# Altium schematic sheet Sheet5.SchDoc
size A4
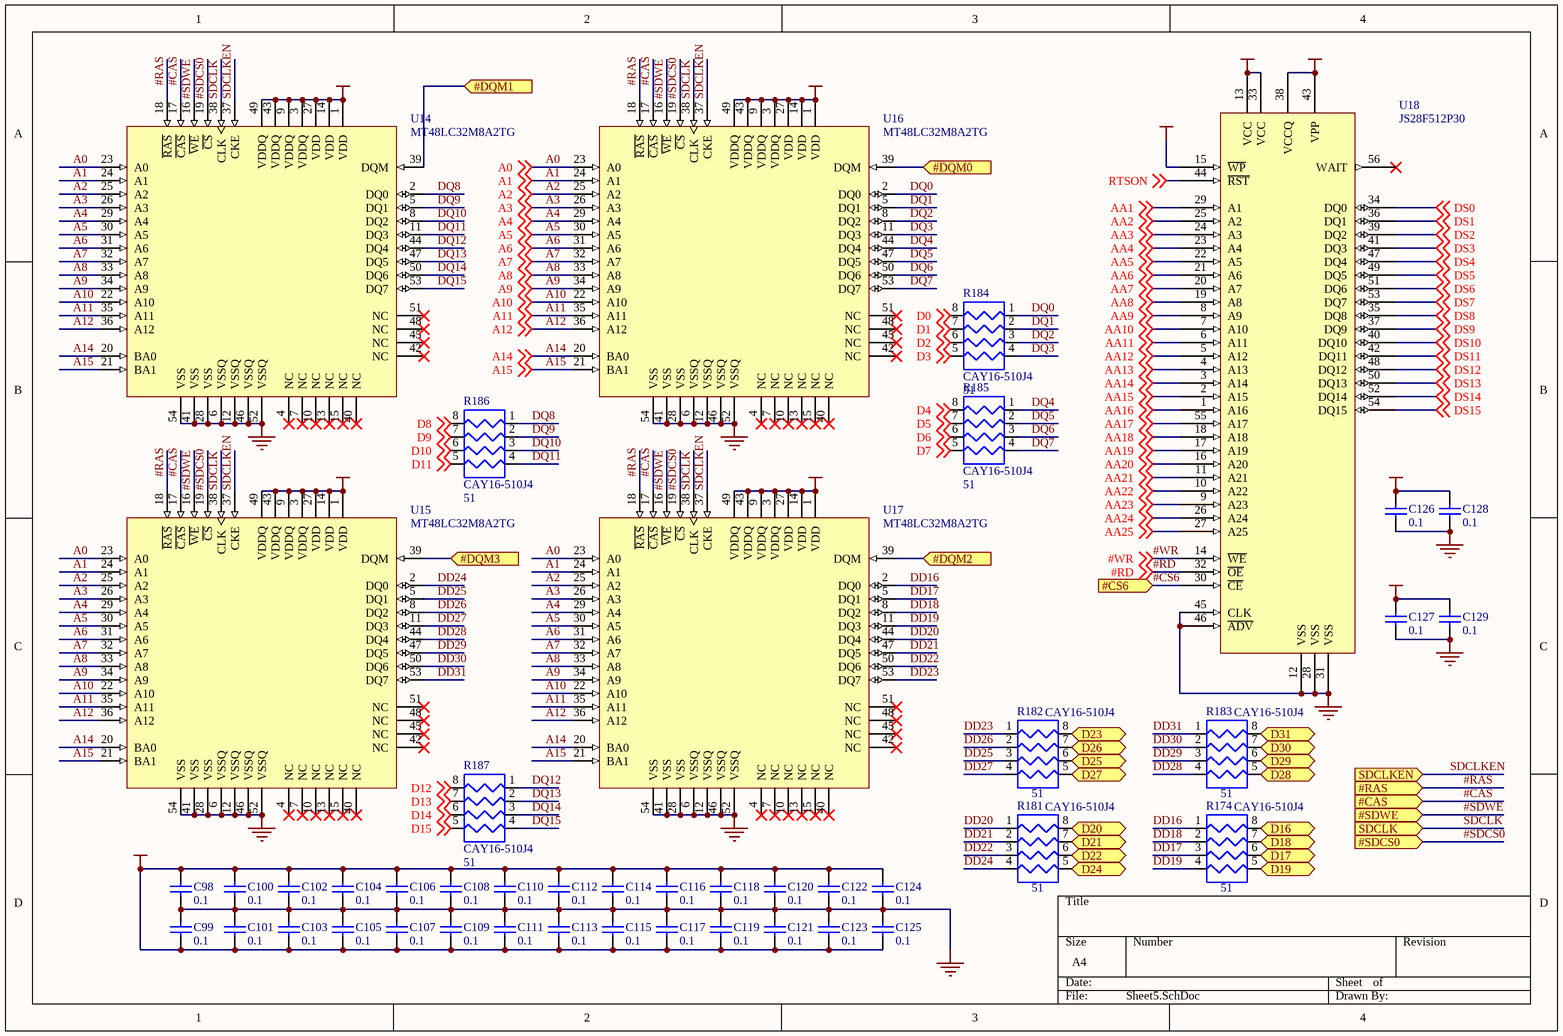
[diagram p0: Sheet5.SchDoc]

## Parts
C98  0.1  [0603]
C99  0.1  [0603]
C100  0.1  [0603]
C101  0.1  [0603]
C102  0.1  [0603]
C103  0.1  [0603]
C104  0.1  [0603]
C105  0.1  [0603]
C106  0.1  [0603]
C107  0.1  [0603]
C108  0.1  [0603]
C109  0.1  [0603]
C110  0.1  [0603]
C111  0.1  [0603]
C112  0.1  [0603]
C113  0.1  [0603]
C114  0.1  [0603]
C115  0.1  [0603]
C116  0.1  [0603]
C117  0.1  [0603]
C118  0.1  [0603]
C119  0.1  [0603]
C120  0.1  [0603]
C121  0.1  [0603]
C122  0.1  [0603]
C123  0.1  [0603]
C124  0.1  [0603]
C125  0.1  [0603]
C126  0.1  [0603]
C127  0.1  [0603]
C128  0.1  [0603]
C129  0.1  [0603]
R174  CAY16-510J4  value 51  [CAY16-J4]
R181  CAY16-510J4  value 51  [CAY16-J4]
R182  CAY16-510J4  value 51  [CAY16-J4]
R183  CAY16-510J4  value 51  [CAY16-J4]
R184  CAY16-510J4  value 51  [CAY16-J4]
R185  CAY16-510J4  value 51  [CAY16-J4]
R186  CAY16-510J4  value 51  [CAY16-J4]
R187  CAY16-510J4  value 51  [CAY16-J4]
U14  MT48LC32M8A2TG  [TSSOP2(0.44m)]
U15  MT48LC32M8A2TG  [TSSOP2(0.44m)]
U16  MT48LC32M8A2TG  [TSSOP2(0.44m)]
U17  MT48LC32M8A2TG  [TSSOP2(0.44m)]
U18  JS28F512P30  [TSOP56]

## Ports
#CAS (in), #CS6 (in), #DQM0 (in), #DQM1 (in), #DQM2 (in), #DQM3 (in), #RAS (in), #SDCS0 (in), #SDWE (in), D16 (bidir), D17 (bidir), D18 (bidir), D19 (bidir), D20 (bidir), D21 (bidir), D22 (bidir), D23 (bidir), D24 (bidir), D25 (bidir), D26 (bidir), D27 (bidir), D28 (bidir), D29 (bidir), D30 (bidir), D31 (bidir), SDCLK (in), SDCLKEN (in)

## Nets
GND: C98.1 C99.2 C100.1 C101.2 C102.1 C103.2 C104.1 C105.2 C106.1 C107.2 C108.1 C109.2 C110.1 C111.2 C112.1 C113.2 C114.1 C115.2 C116.1 C117.2 C118.1 C119.2 C120.1 C121.2 C122.1 C123.2 C124.1 C125.2 C126.1 C127.1 C128.1 C129.1 U14.6(VSSQ) U14.12(VSSQ) U14.28(VSS) U14.41(VSS) U14.46(VSSQ) U14.52(VSSQ) U14.54(VSS) U15.6(VSSQ) U15.12(VSSQ) U15.28(VSS) U15.41(VSS) U15.46(VSSQ) U15.52(VSSQ) U15.54(VSS) U16.6(VSSQ) U16.12(VSSQ) U16.28(VSS) U16.41(VSS) U16.46(VSSQ) U16.52(VSSQ) U16.54(VSS) U17.6(VSSQ) U17.12(VSSQ) U17.28(VSS) U17.41(VSS) U17.46(VSSQ) U17.52(VSSQ) U17.54(VSS) U18.12(VSS) U18.28(VSS) U18.31(VSS) U18.45(CLK) U18.46(~{ADV})
VCCCORE: C127.2 C129.2 U18.13(VCC) U18.33(VCC)
VCCIO: C98.2 C99.1 C100.2 C101.1 C102.2 C103.1 C104.2 C105.1 C106.2 C107.1 C108.2 C109.1 C110.2 C111.1 C112.2 C113.1 C114.2 C115.1 C116.2 C117.1 C118.2 C119.1 C120.2 C121.1 C122.2 C123.1 C124.2 C125.1 C126.2 C128.2 U14.1(VDD) U14.3(VDDQ) U14.9(VDDQ) U14.14(VDD) U14.27(VDD) U14.43(VDDQ) U14.49(VDDQ) U15.1(VDD) U15.3(VDDQ) U15.9(VDDQ) U15.14(VDD) U15.27(VDD) U15.43(VDDQ) U15.49(VDDQ) U16.1(VDD) U16.3(VDDQ) U16.9(VDDQ) U16.14(VDD) U16.27(VDD) U16.43(VDDQ) U16.49(VDDQ) U17.1(VDD) U17.3(VDDQ) U17.9(VDDQ) U17.14(VDD) U17.27(VDD) U17.43(VDDQ) U17.49(VDDQ) U18.15(~{WP}) U18.38(VCCQ) U18.43(VPP)
#CAS: U14.17(~{CAS}) U15.17(~{CAS}) U16.17(~{CAS}) U17.17(~{CAS}) ; port #CAS
#CS6: U18.30(~{CE}) ; port #CS6
#DQM0: U16.39(DQM) ; port #DQM0
#DQM1: U14.39(DQM) ; port #DQM1
#DQM2: U17.39(DQM) ; port #DQM2
#DQM3: U15.39(DQM) ; port #DQM3
#RAS: U14.18(~{RAS}) U15.18(~{RAS}) U16.18(~{RAS}) U17.18(~{RAS}) ; port #RAS
#RD: U18.32(~{OE}) ; off-sheet #RD
#SDCS0: U14.19(~{CS}) U15.19(~{CS}) U16.19(~{CS}) U17.19(~{CS}) ; port #SDCS0
#SDWE: U14.16(~{WE}) U15.16(~{WE}) U16.16(~{WE}) U17.16(~{WE}) ; port #SDWE
#WR: U18.14(~{WE}) ; off-sheet #WR
A0: U14.23(A0) U15.23(A0) U16.23(A0) U17.23(A0) ; off-sheet A0
A1: U14.24(A1) U15.24(A1) U16.24(A1) U17.24(A1) ; off-sheet A1
A2: U14.25(A2) U15.25(A2) U16.25(A2) U17.25(A2) ; off-sheet A2
A3: U14.26(A3) U15.26(A3) U16.26(A3) U17.26(A3) ; off-sheet A3
A4: U14.29(A4) U15.29(A4) U16.29(A4) U17.29(A4) ; off-sheet A4
A5: U14.30(A5) U15.30(A5) U16.30(A5) U17.30(A5) ; off-sheet A5
A6: U14.31(A6) U15.31(A6) U16.31(A6) U17.31(A6) ; off-sheet A6
A7: U14.32(A7) U15.32(A7) U16.32(A7) U17.32(A7) ; off-sheet A7
A8: U14.33(A8) U15.33(A8) U16.33(A8) U17.33(A8) ; off-sheet A8
A9: U14.34(A9) U15.34(A9) U16.34(A9) U17.34(A9) ; off-sheet A9
A10: U14.22(A10) U15.22(A10) U16.22(A10) U17.22(A10) ; off-sheet A10
A11: U14.35(A11) U15.35(A11) U16.35(A11) U17.35(A11) ; off-sheet A11
A12: U14.36(A12) U15.36(A12) U16.36(A12) U17.36(A12) ; off-sheet A12
A14: U14.20(BA0) U15.20(BA0) U16.20(BA0) U17.20(BA0) ; off-sheet A14
A15: U14.21(BA1) U15.21(BA1) U16.21(BA1) U17.21(BA1) ; off-sheet A15
AA1: U18.29(A1) ; off-sheet AA1
AA2: U18.25(A2) ; off-sheet AA2
AA3: U18.24(A3) ; off-sheet AA3
AA4: U18.23(A4) ; off-sheet AA4
AA5: U18.22(A5) ; off-sheet AA5
AA6: U18.21(A6) ; off-sheet AA6
AA7: U18.20(A7) ; off-sheet AA7
AA8: U18.19(A8) ; off-sheet AA8
AA9: U18.8(A9) ; off-sheet AA9
AA10: U18.7(A10) ; off-sheet AA10
AA11: U18.6(A11) ; off-sheet AA11
AA12: U18.5(A12) ; off-sheet AA12
AA13: U18.4(A13) ; off-sheet AA13
AA14: U18.3(A14) ; off-sheet AA14
AA15: U18.2(A15) ; off-sheet AA15
AA16: U18.1(A16) ; off-sheet AA16
AA17: U18.55(A17) ; off-sheet AA17
AA18: U18.18(A18) ; off-sheet AA18
AA19: U18.17(A19) ; off-sheet AA19
AA20: U18.16(A20) ; off-sheet AA20
AA21: U18.11(A21) ; off-sheet AA21
AA22: U18.10(A22) ; off-sheet AA22
AA23: U18.9(A23) ; off-sheet AA23
AA24: U18.26(A24) ; off-sheet AA24
AA25: U18.27(A25) ; off-sheet AA25
D0: R184.8 ; off-sheet D0
D1: R184.7 ; off-sheet D1
D2: R184.6 ; off-sheet D2
D3: R184.5 ; off-sheet D3
D4: R185.8 ; off-sheet D4
D5: R185.7 ; off-sheet D5
D6: R185.6 ; off-sheet D6
D7: R185.5 ; off-sheet D7
D8: R186.8 ; off-sheet D8
D9: R186.7 ; off-sheet D9
D10: R186.6 ; off-sheet D10
D11: R186.5 ; off-sheet D11
D12: R187.8 ; off-sheet D12
D13: R187.7 ; off-sheet D13
D14: R187.6 ; off-sheet D14
D15: R187.5 ; off-sheet D15
D16: R174.8 ; port D16
D17: R174.6 ; port D17
D18: R174.7 ; port D18
D19: R174.5 ; port D19
D20: R181.8 ; port D20
D21: R181.7 ; port D21
D22: R181.6 ; port D22
D23: R182.8 ; port D23
D24: R181.5 ; port D24
D25: R182.6 ; port D25
D26: R182.7 ; port D26
D27: R182.5 ; port D27
D28: R183.5 ; port D28
D29: R183.6 ; port D29
D30: R183.7 ; port D30
D31: R183.8 ; port D31
DD16: R174.1 U17.2(DQ0)
DD17: R174.3 U17.5(DQ1)
DD18: R174.2 U17.8(DQ2)
DD19: R174.4 U17.11(DQ3)
DD20: R181.1 U17.44(DQ4)
DD21: R181.2 U17.47(DQ5)
DD22: R181.3 U17.50(DQ6)
DD23: R182.1 U17.53(DQ7)
DD24: R181.4 U15.2(DQ0)
DD25: R182.3 U15.5(DQ1)
DD26: R182.2 U15.8(DQ2)
DD27: R182.4 U15.11(DQ3)
DD28: R183.4 U15.44(DQ4)
DD29: R183.3 U15.47(DQ5)
DD30: R183.2 U15.50(DQ6)
DD31: R183.1 U15.53(DQ7)
DQ0: R184.1 U16.2(DQ0)
DQ1: R184.2 U16.5(DQ1)
DQ2: R184.3 U16.8(DQ2)
DQ3: R184.4 U16.11(DQ3)
DQ4: R185.1 U16.44(DQ4)
DQ5: R185.2 U16.47(DQ5)
DQ6: R185.3 U16.50(DQ6)
DQ7: R185.4 U16.53(DQ7)
DQ8: R186.1 U14.2(DQ0)
DQ9: R186.2 U14.5(DQ1)
DQ10: R186.3 U14.8(DQ2)
DQ11: R186.4 U14.11(DQ3)
DQ12: R187.1 U14.44(DQ4)
DQ13: R187.2 U14.47(DQ5)
DQ14: R187.3 U14.50(DQ6)
DQ15: R187.4 U14.53(DQ7)
DS0: U18.34(DQ0) ; off-sheet DS0
DS1: U18.36(DQ1) ; off-sheet DS1
DS2: U18.39(DQ2) ; off-sheet DS2
DS3: U18.41(DQ3) ; off-sheet DS3
DS4: U18.47(DQ4) ; off-sheet DS4
DS5: U18.49(DQ5) ; off-sheet DS5
DS6: U18.51(DQ6) ; off-sheet DS6
DS7: U18.53(DQ7) ; off-sheet DS7
DS8: U18.35(DQ8) ; off-sheet DS8
DS9: U18.37(DQ9) ; off-sheet DS9
DS10: U18.40(DQ10) ; off-sheet DS10
DS11: U18.42(DQ11) ; off-sheet DS11
DS12: U18.48(DQ12) ; off-sheet DS12
DS13: U18.50(DQ13) ; off-sheet DS13
DS14: U18.52(DQ14) ; off-sheet DS14
DS15: U18.54(DQ15) ; off-sheet DS15
RTSON: U18.44(~{RST}) ; off-sheet RTSON
SDCLK: U14.38(CLK) U15.38(CLK) U16.38(CLK) U17.38(CLK) ; port SDCLK
SDCLKEN: U14.37(CKE) U15.37(CKE) U16.37(CKE) U17.37(CKE) ; port SDCLKEN

Not connected (* = marked no-connect by the designer): U14 4(NC)* 7(NC)* 10(NC)* 13(NC)* 15(NC)* 40(NC)* 42(NC)* 45(NC)* 48(NC)* 51(NC)*; U15 4(NC)* 7(NC)* 10(NC)* 13(NC)* 15(NC)* 40(NC)* 42(NC)* 45(NC)* 48(NC)* 51(NC)*; U16 4(NC)* 7(NC)* 10(NC)* 13(NC)* 15(NC)* 40(NC)* 42(NC)* 45(NC)* 48(NC)* 51(NC)*; U17 4(NC)* 7(NC)* 10(NC)* 13(NC)* 15(NC)* 40(NC)* 42(NC)* 45(NC)* 48(NC)* 51(NC)*; U18 56(WAIT)*

## Library data of the parts
C98-C129 = C0603: Ceramic Chip Capacitor - Standard; Note: Footprint corresponds to dimensions for bulk cassette packaging. This case size has tightened tolerances.; Published: 17-Jul-2002; LatestRevisionDate: 19-Mar-2004; LatestRevisionNote: Silkscreen size reduced.; DatasheetDocument: Mar-2001; PackageDocument: Mar-2001; PackageReference: 0603; Publisher: Altium Limited; Code_JEITA: 0603; Code_IPC: 1608 [0603]; ComponentLink1Description: Manufacturer Link; ComponentLink1URL: http://www.kemet.com/; ComponentLink2Description: Datasheet; ComponentLink2URL: http://www.kemet.com/kemet/web/homepage/kechome.nsf/vapubfilesname/F3102TA.pdf/$file/F3102TA.pdf; Value: 0.1
R174 R181-R187 = CAY16-J4: Chip Resistor Arrays
U14-U17 = MT48LC32M8A2TG: 32 Meg x 8 Synchronous DRAM; Package Information: Latest Revision: revE, Mar-2002; Code - JEDEC: MS-024-FA; Published: 30-Oct-2002; Datasheet: Latest Revision: Mar-2002, Rev E; Package Reference: TSOP-54; Publisher: Altium Limited
U18 = JS28F512P30: Intel StrataFLASH